# Altium project LoRA_v2.PrjPcb
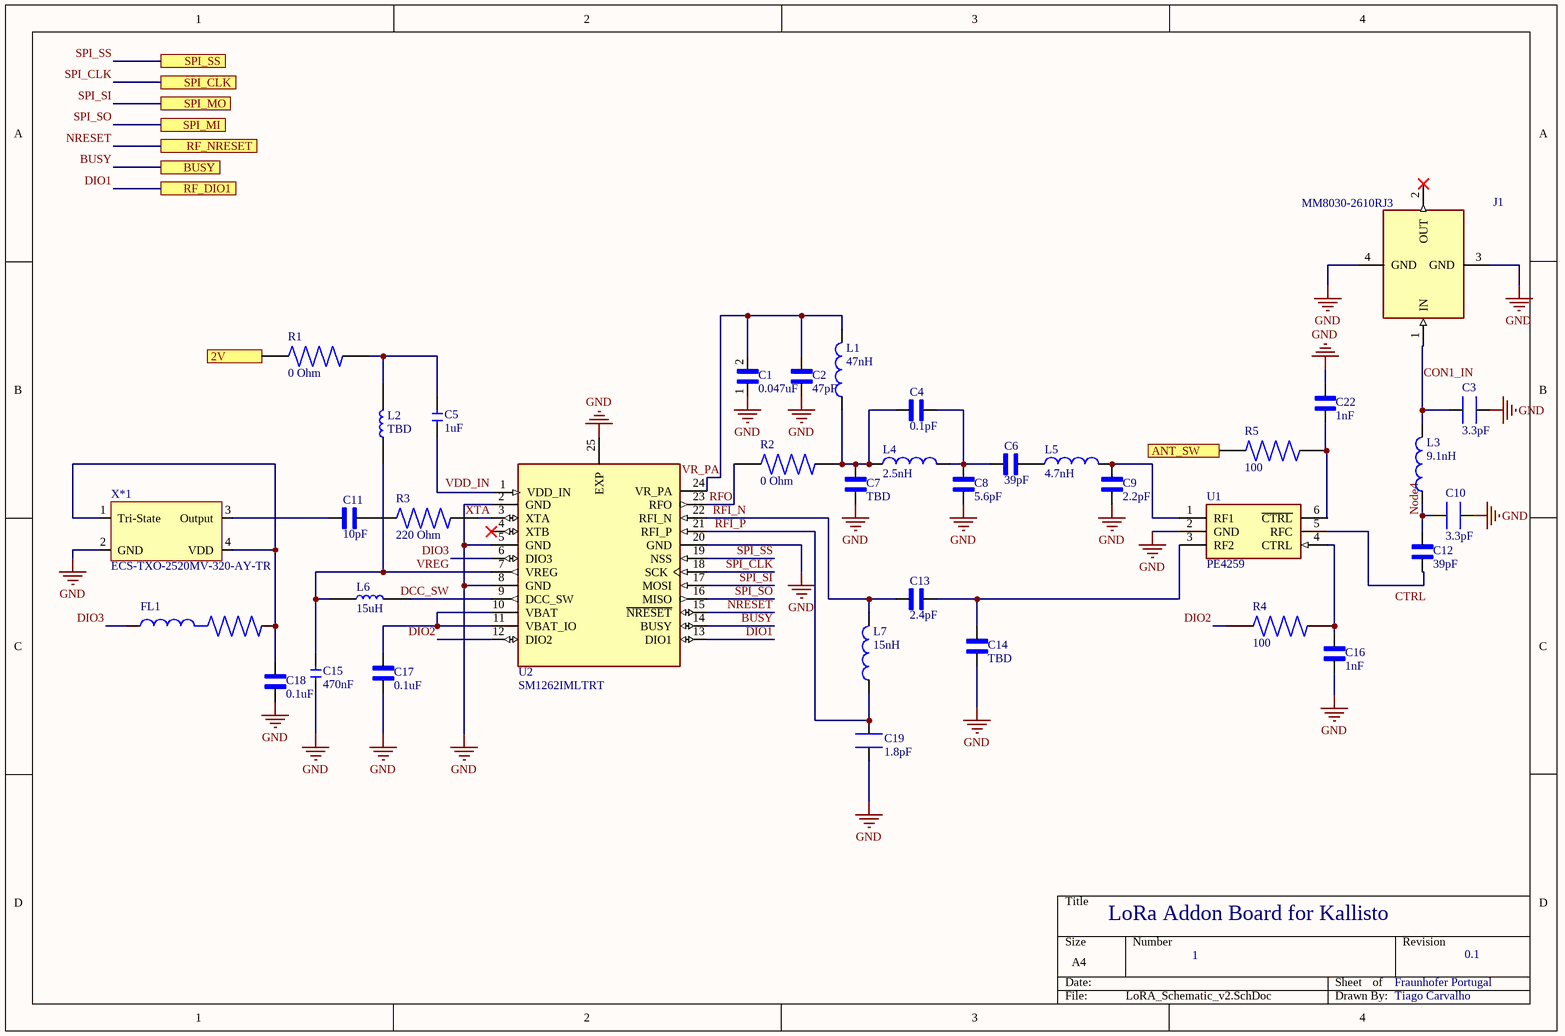
[diagram p0: LoRA_Schematic_v2.SchDoc]
2 sheets, 44 parts. Net scope: flat (ports and power ports of the same name join across sheets).
Board file: LoRA_PCB_v2.PcbDoc
Sheets:
  LoRA_Schematic_v2.SchDoc
  Mikrobus_v2.SchDoc

## Sheet LoRA_Schematic_v2.SchDoc
size A4; SheetNumber: 1; SheetTotal: 2; SPICEModelCacheVSOXQOQN: <root> / <DocumentId>VSOXQOQN</DocumentId> / </root>

### Parts
C1  0.047uF  [CAPC1005X55N]
C2  47pF  [WCAP-CSGP_885012005059]
C3  3.3pF  [WCAP-CSRF_885392005011]
C4  0.1pF  [CAPC1005X55N]
C5  1uF  [C0402]
C6  39pF  [CAPC1005X55N]
C7  TBD  [CAPC1005X55N]
C8  5.6pF  [CAPC1005X55N]
C9  2.2pF  [CAPC1005X55N]
C10  3.3pF  [WCAP-CSRF_885392005011]
C11  10pF  [WCAP-CSGP_885012005055]
C12  39pF  [CAPC1005X55N]
C13  2.4pF  [CAPC1005X55N]
C14  TBD  [CAPC1005X55N]
C15  470nF  [C0402]
C16  1nF  [CAPC1005X56N]
C17  0.1uF  [WCAP-CSGP_885012205037]
C18  0.1uF  [WCAP-CSGP_885012205037]
C19  1.8pF  [WCAP-CSRF_885392005008]
C22  1nF  [CAPC1005X56N]
FL1  BLM15PG100SN1D  [BEADC1005X55N]  (value not drawn)
J1  MM8030-2610RJ3  [MURATA_MM8030-2610RJ3]
L1  47nH  [INDC1005X60N]
L2  TBD  [INDC2012X87N]
L3  9.1nH  [INDC1006X60N]
L4  2.5nH  [INDC1006X60N]
L5  4.7nH  [INDC1006X60N]
L6  15uH  [INDC2012X87N]
L7  15nH  [INDC1006X60N]
R1  0 Ohm  [RESC1005X35N]
R2  0 Ohm  [RESC1005X35N]
R3  220 Ohm  [RESC1005X40N]
R4  100  [RESC1005X40N]
R5  100  [RESC1005X40N]
U1  PE4259  [PCBComponent_1]
U2  SM1262IMLTRT  [SX]
X*1  ECS-TXO-2520MV-320-AY-TR  [OSCDFN250X200X89-4N]

### Ports
2V, ANT_SW, BUSY, RF_DIO1, RF_NRESET, SPI_CLK, SPI_MI, SPI_MO, SPI_SS

### Nets
GND: C1.1 C2.1 C3.2 C7.1 C8.1 C9.2 C10.2 C14.1 C15.1 C16.1 C17.1 C18.1 C19.1 C22.2 J1.3(GND) J1.4(GND) U1.2(GND) U2.2(GND) U2.5(GND) U2.8(GND) U2.20(GND) U2.25(EXP) X*1.2(GND)
BUSY: U2.14(BUSY) ; port BUSY
DCC_SW: L6.2 U2.9(DCC_SW)
DIO1: U2.13(DIO1) ; port RF_DIO1
DIO2: R4.1 U2.12(DIO2)
DIO3: FL1.1 U2.6(DIO3)
Node4: C10.1 C12.1 L3.1
NRESET: U2.15(~{NRESET}) ; port RF_NRESET
RFI_N: C13.2 L7.2 U2.22(RFI_N)
RFI_P: C19.2 L7.1 U2.21(RFI_P)
RFO: R2.1 U2.23(RFO)
SPI_CLK: U2.18(SCK) ; port SPI_CLK
SPI_SI: U2.17(MOSI) ; port SPI_MO
SPI_SO: U2.16(MISO) ; port SPI_MI
SPI_SS: U2.19(NSS) ; port SPI_SS
VR_PA: C1.2 C2.2 L1.2 U2.24(VR_PA)
VREG: C15.2 L2.1 L6.1 U2.7(VREG)
XTA: R3.2 U2.3(XTA)
NetC3_1: C3.1 J1.1(IN) L3.2
NetC4_1: C4.1 C6.2 C8.2 L4.2
NetC4_2: C4.2 C7.2 L1.1 L4.1 R2.2
NetC5_1: C5.1 U2.1(VDD_IN)
NetC5_2: C5.2 L2.2 R1.2
NetC6_1: C6.1 L5.1
NetC9_1: C9.1 L5.2 U1.1(RF1)
NetC11_1: C11.1 R3.1
NetC11_2: C11.2 X*1.3(Output)
NetC12_2: C12.2 U1.5(RFC)
NetC13_1: C13.1 C14.2 U1.3(RF2)
NetC16_2: C16.2 R4.2 U1.4(CTRL)
NetC17_2: C17.2 U2.10(VBAT) U2.11(VBAT_IO)
NetC18_2: C18.2 FL1.2 X*1.1(Tri-State) X*1.4(VDD)
NetC21_2: R1.1 ; port 2V
NetC22_1: C22.1 R5.2 U1.6(~{CTRL})
NetP2_5: R5.1 ; port ANT_SW

Not connected (* = marked no-connect by the designer): J1 2(OUT)*; U2 4(XTB)*

### Notes on the sheet
- LoRa Addon Board for Kallisto
- 1
- Fraunhofer Portugal
- 0.1
- Tiago Carvalho
- Labels drawn without touching a wire or pin: CON1_IN, CTRL, VDD_IN

### Library data of the parts
C1 = GRM155R71C473KA01J: SMD Capacitor X7R(EIA) with Capacitance: 47000pF Tol. 10%. Rated Voltage: 16Vdc; MF: muRata; Package: 0402; Price: None; Value: 0.047uF; MP: GRM155R71C473KA01J; Availability: *; MF number: GRM155R71C473KA01J
C2 = 885012005059: <b> WCAP-CSGP Ceramic Capacitors <br> <br> <br><b>Characteristics </b><br> </b><br>Multilayer Ceramic Chip Capacitor <br>Recommended soldering:Reflow, for 0603 and 0805 wave soldering is also allowed <br>Operating temperature:-55 Â°C to +125 Â°C; <br>Ceramic characteristics: Class I - NPO ; Class II -X7R, X5R <br>High performance ceramic <br>High capacitance stability <br>Minimal aging  <br>Termination:Cu/Ni/Sn <br>   <br><a href="http://katalog.we-online.de/media/images/eisos/WCAP-CSGP_pf2.jpg" title="Enlarge picture"> <img src="http://katalog.we-online.de/media/thumbs2/eisos/thb_WCAP-CSGP_pf2.jpg" width="320"></a><p> Details see: <a href="http://katalog.we-online.de/en/pbs/WCAP-CSGP-0402?">http://katalog.we-online.de/en/pbs/WCAP-CSGP-0402? </a><p>Created:  2015-01-28 <br>2015 (C) Wurth Elektronik; MF: wurth; Package: 0402; Price: None; Value: 47pF; MP: 885012005059; Availability: *; MF number: 885012005059
C3 C10 = 885392005011: <b> WCAP-CSRF Radio Frequency MLCC <br> <br> <br><b>Characteristics </b><br> </b><br>Multilayer ceramic chip capacitor <br>Recommended soldering: Reflow <br>Operating temperature: -55 Â°C up to +125 Â°C <br>Capacitance range: 0.2 pF - 33 pF<br> Rated voltage: 25 V(DC) and 50 V(DC) <br>Size: 0201 and 0402 <br>High frequency  <br> <br> <br><b>Applications </b><br> <br>High frequency applications <br>Antenna matching  <br> <br> <br><a href="https://katalog.we-online.de/media/images/v2/Family_WCAP-CSRF.jpg" title="Enlarge picture"> <img src="https://katalog.we-online.de/media/images/v2/Family_WCAP-CSRF.jpg" width="320"></a><p> Details see: <a href="https://katalog.we-online.de/en/pbs/WCAP-CSRF#vs_ct:2">https://katalog.we-online.de/en/pbs/WCAP-CSRF#vs_ct:2<br> <br></a><p>Created By Yingchun,Shan 2018-11-14 <br><br>20178(C) Wurth Elektronik; MF: Wurth; Package: 0402; Price: None; Value: 3.3pF; MP: 885392005011; Availability: Unavailable
C4 = CC0402BRNPO9BN3R3: 0402 3.3 pF 50 V Â±0.1 pF Tolerance NP0 SMT Multilayer Ceramic Capacitor; MF: Yageo; Price: None; Availability: Good; SnapEDA_Link: https://www.snapeda.com/parts/CC0402BRNPO9BN3R3/Yageo/view-part/1821368/?ref=snap; Value: 0.1pF; Check_prices: https://www.snapeda.com/parts/CC0402BRNPO9BN3R3/Yageo/view-part/1821368/?ref=eda; Purchase-URL: https://pricing.snapeda.com/search/part/CC0402BRNPO9BN3R3/?ref=eda; MP: CC0402BRNPO9BN3R3; Package: 0402 Yageo
C5 = CERAMIC-1UF-10V-10%-X5R(0402): 1ÂµF Â±10% 10V Ceramic Capacitor X5R 0402 _1005 Metric_; MP: CC0402KRX5R6BB105; MF: Yageo; Value: 1uF; Package: 0402 Yageo; SnapEDA_Link: https://www.snapeda.com/parts/CC0402KRX5R6BB105/Yageo/view-part/105546/?ref=snap; Price: None; Availability: Unavailable
C6 C12 = C0402C390J5GAC: Package: None; Price: None; Value: 39pF; MP: C0402C390J5GAC; Availability: Unavailable
C7 C14 = VJ0402A5R6CXAPW1BC: MF: Vishay; Price: None; Availability: In Stock; Package: 0402 Vishay; Value: TBD
C8 = VJ0402A5R6CXAPW1BC: Cap Ceramic 5.6pF 50V C0G 0.25pF SMD 0402 125Â°C Paper T/R; MF: Vishay; Price: None; Availability: In Stock; Package: 0402 Vishay; MP: VJ0402A5R6CXAPW1BC; Value: 5.6pF; SnapEDA_Link: https://www.snapeda.com/parts/VJ0402A5R6CXAPW1BC/Vishay/view-part/?ref=snap; Check_prices: https://www.snapeda.com/parts/VJ0402A5R6CXAPW1BC/Vishay/view-part/?ref=eda; Purchase-URL: https://pricing.snapeda.com/search/part/VJ0402A5R6CXAPW1BC/?ref=eda
C9 = CC0402BRNPO9BN2R2: CAP CER 2.2PF 50V C0G/NPO 0402; MF: YAGEO; Package: 0402; Price: None; Value: 2.2pF; MP: CC0402BRNPO9BN2R2; Availability: »
C11 = 885012005055: <b> WCAP-CSGP Ceramic Capacitors <br> <br> <br><b>Characteristics </b><br> </b><br>Multilayer Ceramic Chip Capacitor <br>Recommended soldering:Reflow, for 0603 and 0805 wave soldering is also allowed <br>Operating temperature:-55 Â°C to +125 Â°C; <br>Ceramic characteristics: Class I - NPO ; Class II -X7R, X5R <br>High performance ceramic <br>High capacitance stability <br>Minimal aging  <br>Termination:Cu/Ni/Sn <br>   <br><a href="http://katalog.we-online.de/media/images/eisos/WCAP-CSGP_pf2.jpg" title="Enlarge picture"> <img src="http://katalog.we-online.de/media/thumbs2/eisos/thb_WCAP-CSGP_pf2.jpg" width="320"></a><p> Details see: <a href="http://katalog.we-online.de/en/pbs/WCAP-CSGP-0402?">http://katalog.we-online.de/en/pbs/WCAP-CSGP-0402? </a><p>Created:  2015-01-28 <br>2015 (C) Wurth Elektronik; Package: None; Price: None; Value: 10pF; MP: 885012005055; Availability: Unavailable
C13 = CC0402BRNPO9BN2R4: 2.4pF Â±0.1pF 50V Ceramic Capacitor C0G, NP0 0402 (1005 Metric); MF: Yageo; MP: CC0402BRNPO9BN2R4; Value: 2.4pF; Availability: Good; Package: 0402 Yageo; Check_prices: https://www.snapeda.com/parts/CC0402BRNPO9BN2R4/Yageo/view-part/1824876/?ref=eda; Purchase-URL: https://pricing.snapeda.com/search/part/CC0402BRNPO9BN2R4/?ref=eda; SnapEDA_Link: https://www.snapeda.com/parts/CC0402BRNPO9BN2R4/Yageo/view-part/1824876/?ref=snap; Price: None
C15 = CERAMIC-470NF-10V-10%-X5R(0402): 0.47ÂµF Â±10% 10V Ceramic Capacitor X5R 0402 (1005 Metric); MF: Yageo; MP: CC0402KRX5R6BB474; Availability: Unavailable; Arrow_Americas-Purchase-URL: https://snapeda.com/shop?store=Arrow+Americas&id=105580; Value: 470nF; Price: None; Mouser-Purchase-URL: https://snapeda.com/shop?store=Mouser&id=105580; DigiKey-Purchase-URL: https://snapeda.com/shop?store=DigiKey&id=105580; SnapEDA_Link: https://www.snapeda.com/parts/CC0402KRX5R6BB474/Yageo/view-part/105580/?ref=snap; Package: 0402 Yageo
C16 C22 = 0402ZD102KAT2A: Ceramic Multilayer Capacitor; Capacitor Type:General Purpose; Capacitance:1000pF; Capacitance Tolerance:Â± 10%; Voltage Rating:10VDC; Capacitor Dielectric Type:Multilayer Ceramic; Package/Case:0402; Termination Type:SMD ;RoHS Compliant: Yes; MF: AVX; Package: 0402; Price: None; Value: 1nF; MP: 0402ZD102KAT2A; Availability: Unavailable
C17 C18 = 885012205037: WCAP-CSGP General Purpose MLCC; SMT 0402; X7R; 100nF 10%; 16V; -55C to +125C; Tech. PN X7R0402104K016DFCT10000; MF: Wurth Electronics Inc; Price: None; Mouser-Purchase-URL: https://snapeda.com/shop?store=Mouser&id=4217417; Package: 0402 Wurth Electronics; DigiKey-Purchase-URL: https://snapeda.com/shop?store=DigiKey&id=4217417; Availability: Warning; MP: 885012205037; Value: 0.1uF; SnapEDA_Link: https://www.snapeda.com/parts/885012205037/Wurth%20Electronics%20Inc/view-part/4217417/?ref=snap; BuyPart: https://www.snapeda.com/parts/885012205037/Wurth%20Electronics%20Inc/view-part/4217417/?ref=eda
C19 = 885392005008: <b> WCAP-CSRF Radio Frequency MLCC <br> <br> <br><b>Characteristics </b><br> </b><br>Multilayer ceramic chip capacitor <br>Recommended soldering: Reflow <br>Operating temperature: -55 Â°C up to +125 Â°C <br>Capacitance range: 0.2 pF - 33 pF<br> Rated voltage: 25 V(DC) and 50 V(DC) <br>Size: 0201 and 0402 <br>High frequency  <br> <br> <br><b>Applications </b><br> <br>High frequency applications <br>Antenna matching  <br> <br> <br><a href="https://katalog.we-online.de/media/images/v2/Family_WCAP-CSRF.jpg" title="Enlarge picture"> <img src="https://katalog.we-online.de/media/images/v2/Family_WCAP-CSRF.jpg" width="320"></a><p> Details see: <a href="https://katalog.we-online.de/en/pbs/WCAP-CSRF#vs_ct:2">https://katalog.we-online.de/en/pbs/WCAP-CSRF#vs_ct:2<br> <br></a><p>Created By Yingchun,Shan 2018-11-14 <br><br>20178(C) Wurth Elektronik; Package: None; Price: None; Value: 1.8pF; MP: 885392005008; Availability: Unavailable
FL1 = BLM15PG100SN1D: FERRITE, BEAD, 0402, 0.025OHM, 1A; Package: None; Price: None; Value: *; MP: BLM15PG100SN1D; Availability: Unavailable
J1 = MM8030-2610RJ3: SWG Connector Receptacle, Female Socket 50Ohm Surface Mount Solder; MF: Murata; MP: MM8030-2610RJ3; Package: None; SnapEDA_Link: https://www.snapeda.com/parts/MM8030-2610RJ3/Murata%20Electronics%20North%20America/view-part/271470/?ref=snap; Digi-Key_Purchase_URL: https://www.digikey.com/product-detail/en/murata-electronics/MM8030-2610RJ3/490-5907-1-ND/3635133?utm_source=snapeda&utm_medium=aggregator&utm_campaign=symbol; Value: *; Digi-Key_Part_Number: 490-5907-1-ND
L1 = LQW15AN47NJ00D: LQW15 Series 0402 47 nH Â±5 % 210 mA 1.08 Ohm SMT Unshielded Wirewound Inductor; MF: Murata; Package: 0402; Price: None; Value: 47nH; MP: LQW15AN47NJ00D; Availability: Unavailable
L2 = MLZ2012M150WT000: Package: 0402; Price: None; Value: TBD; Availability: Unavailable
L3 = LQW15AN9N1H00D: Inductor with Inductance: 9.1nH Tol. +/-3%, Package: 0402 (1005); MF: Murata; Mouser-Purchase-URL: https://snapeda.com/shop?store=Mouser&id=1510094; SnapEDA_Link: https://www.snapeda.com/parts/LQW15AN9N1H00D/Murata%20Electronics%20North%20America/view-part/1510094/?ref=snap; Availability: Good; MP: LQW15AN9N1H00D; DigiKey-Purchase-URL: https://snapeda.com/shop?store=DigiKey&id=1510094; Package: 1006 Murata; Price: None; Value: 9.1nH; BuyPart: https://www.snapeda.com/parts/LQW15AN9N1H00D/Murata%20Electronics%20North%20America/view-part/1510094/?ref=eda
L4 = LQW15AN2N5C00D: Inductor with Inductance: 2.5nH Tol. +/-0.2nH, Package: 0402 _1005_; MF: Murata; SnapEDA_Link: https://www.snapeda.com/parts/LQW15AN2N5C00D/Murata%20Electronics%20North%20America/view-part/1500635/?ref=snap; MP: LQW15AN2N5C00D; Digi-Key_Part_Number: 490-6798-1-ND; Package: 1006 Murata; Digi-Key_Purchase_URL: https://www.digikey.com.tr/product-detail/en/murata-electronics/LQW15AN2N5C00D/490-6798-1-ND/3845995?utm_source=snapeda&utm_medium=aggregator&utm_campaign=symbol; Value: 2.5nH
L5 = LQW15AN4N7C00D: INDUCTOR, 0402, 4.7NH; Inductor Type:Chip Coils; Inductance Tolerance:Â± 0.2nH; Resistance:0.07ohm; DC Current Max:750mA; Case Style:0402; Q Factor @ Vr, F:25; Core Material:Alumina; External Depth:0.6mm; External Length / ;RoHS Compliant: Yes; MF: Murata; Package: None; Price: None; Value: 4.7nH; MP: LQW15AN4N7C00D; Availability: Unavailable
L6 = MLZ2012M150WT000: Surface Mount High Frequency Inductor, MLZ Series, 15 H, 20%, 0805 [2012 Metric], 22 MHz; MF: TDK-Lambda; Package: 0402; Price: None; Value: 15uH; MP: MLZ2012M150WT000; Availability: Unavailable
L7 = LQW15AN15NH00D: Inductor with Inductance: 15nH Tol. +/-3%, Package: 0402 (1005); MF: Murata; Price: None; MP: LQW15AN15NH00D; SnapEDA_Link: https://www.snapeda.com/parts/LQW15AN15NH00D/Murata%20Electronics%20North%20America/view-part/1499752/?ref=snap; Availability: Good; Mouser-Purchase-URL: https://snapeda.com/shop?store=Mouser&id=1499752; DigiKey-Purchase-URL: https://snapeda.com/shop?store=DigiKey&id=1499752; Package: 1006 Murata; Check_prices: https://www.snapeda.com/parts/LQW15AN15NH00D/Murata%20Electronics%20North%20America/view-part/1499752/?ref=eda; Value: 15nH
R1 R2 = CRCW04020000Z0EDC: 0 Ohms Jumper 0.063W, 1/16W Chip Resistor 0402 (1005 Metric) Thick Film; MF: Vishay Dale; Package: 1005 Yageo; DigiKey-Purchase-URL: https://snapeda.com/shop?store=DigiKey&id=3593962; Value: 0 Ohm; Mouser-Purchase-URL: https://snapeda.com/shop?store=Mouser&id=3593962; Digi-Key_Part_Number: 541-4062-1-ND; SnapEDA_Link: https://www.snapeda.com/parts/CRCW04020000Z0EDC/Vishay%20Dale/view-part/3593962/?ref=snap; MP: CRCW04020000Z0EDC; Check_prices: https://www.snapeda.com/parts/CRCW04020000Z0EDC/Vishay%20Dale/view-part/3593962/?ref=eda
R3 = CRCW0402220RJNED: Res Thick Film 0402 220 Ohm 5% 1/16W Â±200ppm/Â°C Molded SMD SMD Paper T/R; Package: None; Price: None; Value: 220 Ohm; MP: CRCW0402220RJNED; Availability: Unavailable
R4 R5 = CRCW0402100RFKTD: Res Thick Film 0402 100 Ohm 1% 1/16W Â±100ppm/Â°C Molded SMD SMD Paper T/R; Package: 0402; Price: None; Value: 100; MP: CRCW0402100RFKTD; Availability: *
U1 = PE4259: UltraCMOSÂ® Switch, SPDT For Use With PE4259; MF: pSemi; Value: *; Package: SOT-363 Peregrine Semiconductor; MP: PE4259
U2 = SM1262: IC RF TxRx Only General ISM < 1GHz LoRaWAN 150MHz ~ 960MHz 24-VFQFN Exposed Pad; MP: 1262IMLTRT
X*1 = TXCO: 32MHz TCXO CMOS Oscillator 1.7V ~ 3.6V Enable/Disable 4-SMD, No Lead

## Sheet Mikrobus_v2.SchDoc
size A4; SheetNumber: 2; SheetTotal: 2
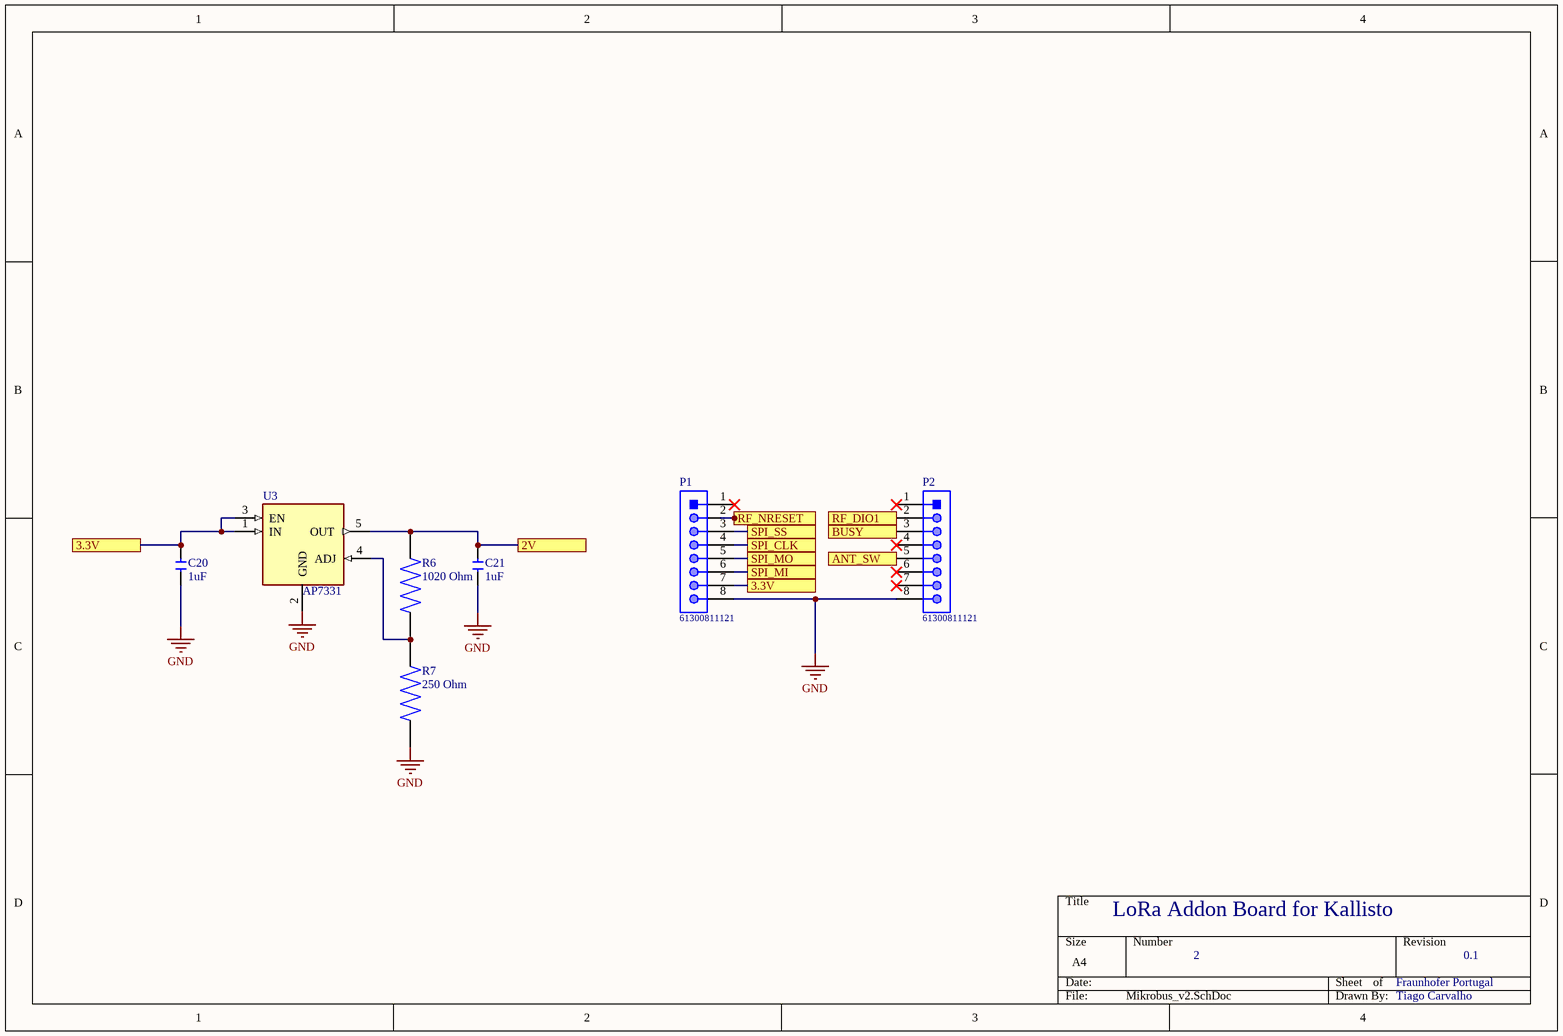
[diagram p1: Mikrobus_v2.SchDoc]

### Parts
C20  1uF  [C0402]
C21  1uF  [C0402]
P1  61300811121  [61300811121]
P2  61300811121  [61300811121]
R6  1020 Ohm  [RESC1005X40N]
R7  250 Ohm  [RESC1005X35N]
U3  AP7331  [SOT95P285X145-5N]

### Ports
2V, 3.3V, ANT_SW, BUSY, RF_DIO1, RF_NRESET, SPI_CLK, SPI_MI, SPI_MO, SPI_SS

### Nets
GND: C20.1 C21.1 P1.8 P2.8 R7.1 U3.2(GND)
BUSY: P2.3 ; port BUSY
DIO1: P2.2 ; port RF_DIO1
NRESET: P1.2 ; port RF_NRESET
SPI_CLK: P1.4 ; port SPI_CLK
SPI_SI: P1.5 ; port SPI_MO
SPI_SO: P1.6 ; port SPI_MI
SPI_SS: P1.3 ; port SPI_SS
NetC20_2: C20.2 P1.7 U3.1(IN) U3.3(EN) ; port 3.3V
NetC21_2: C21.2 R6.2 U3.5(OUT) ; port 2V
NetP2_5: P2.5 ; port ANT_SW
NetR6_1: R6.1 R7.2 U3.4(ADJ)

Not connected (* = marked no-connect by the designer): P1 1*; P2 1* 4* 6* 7*

### Notes on the sheet
- LoRa Addon Board for Kallisto
- 2
- Fraunhofer Portugal
- 0.1
- Tiago Carvalho

### Library data of the parts
C20 C21 = CERAMIC-1UF-10V-10%-X5R(0402): as C5 on sheet LoRA_Schematic_v2; Value: 1uF; Package: 0402 Yageo; SnapEDA_Link: https://www.snapeda.com/parts/CC0402KRX5R6BB105/Yageo/view-part/105546/?ref=snap; Price: None; Availability: Unavailable
P1 P2 = CMP-1502-01076-1: THT Vertical Pin Header WR-PHD, Pitch 2.54 mm, Single Row, 8 pins; Manufacturer: Wurth Elektronik; Rated Current: 3A; Pin Number: 8; Working Voltage: 250VAC; Gender: Male; Contact Resistance: 20mOhm; Pitch: 2.54mm; Withstanding Voltage: 500VAC; Publisher: WurthElektronik; Operating Temperature: -40to105degC; Orientation: Vertical; Row Number: Single; Part Number: 61300811121; Package Reference: 61300811121; Mounting Technology: THT; Packaging: Bag; Manufacturer URL: http://www.we-online.de; Datasheet URL: https://katalog.we-online.de/em/datasheet/6130xx11121.pdf
R6 = CRCW04021K02FKTD: Res Thick Film 0402 1.02K Ohm 1% 1/16W Â±100ppm/Â°C Molded SMD SMD Paper T/R; Package: None; Price: None; Value: 1020 Ohm; MP: CRCW04021K02FKTD; Availability: Unavailable
R7 = CRCW0402255RFKEDC: Package: None; Price: None; Value: 250 Ohm; MP: CRCW0402255RFKEDC; Availability: Unavailable
U3 = AP7331-18WG-7: Linear Voltage Regulator IC 1 Output 300mA SOT-25; MF: Diodes Inc.; MP: AP7331-18WG-7; Package: SOT-753 Diodes Inc.; Availability: Unavailable; Price: None; SnapEDA_Link: https://www.snapeda.com/parts/AP7331-18WG-7/Diodes%20Inc./view-part/494406/?ref=snap; Value: *

## Nets that join several sheets
GND: LoRA_Schematic_v2 (23 pins), Mikrobus_v2 (6 pins)
BUSY: LoRA_Schematic_v2 (U2.14), Mikrobus_v2 (P2.3)
DIO1: LoRA_Schematic_v2 (U2.13), Mikrobus_v2 (P2.2)
NetC21_2: LoRA_Schematic_v2 (R1.1), Mikrobus_v2 (C21.2 R6.2 U3.5)
NetP2_5: LoRA_Schematic_v2 (R5.1), Mikrobus_v2 (P2.5)
NRESET: LoRA_Schematic_v2 (U2.15), Mikrobus_v2 (P1.2)
SPI_CLK: LoRA_Schematic_v2 (U2.18), Mikrobus_v2 (P1.4)
SPI_SI: LoRA_Schematic_v2 (U2.17), Mikrobus_v2 (P1.5)
SPI_SO: LoRA_Schematic_v2 (U2.16), Mikrobus_v2 (P1.6)
SPI_SS: LoRA_Schematic_v2 (U2.19), Mikrobus_v2 (P1.3)